# Altium schematic sheet module_slot.SchDoc: PCI Express Mini 52Pin
size A4
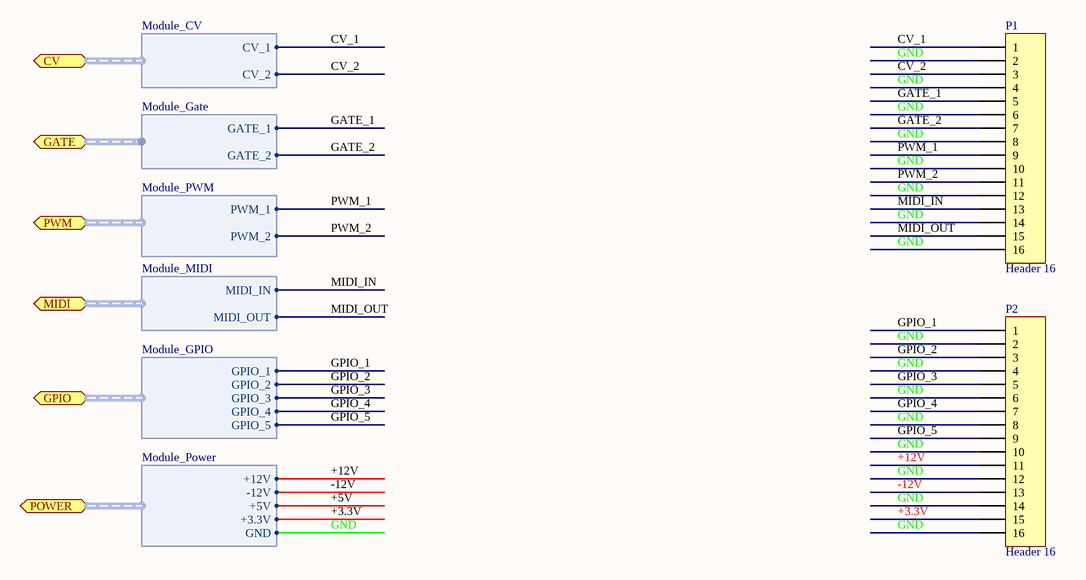
[diagram p0: module_slot.SchDoc]

## Parts
P1  Header 16  [HDR1X16]
P2  Header 16  [HDR1X16]

## Ports
CV (harness Module_CV), GATE (harness Module_Gate), GPIO (harness Module_GPIO), MIDI (harness Module_MIDI), POWER (harness Module_Power), PWM (harness Module_PWM)

## Harnesses
Module_CV: CV_1, CV_2
Module_Gate: GATE_1, GATE_2
Module_PWM: PWM_1, PWM_2
Module_MIDI: MIDI_IN, MIDI_OUT
Module_GPIO: GPIO_1, GPIO_2, GPIO_3, GPIO_4, GPIO_5
Module_Power: +12V, -12V, +5V, GND, +3.3V

## Nets
+3.3V: P2.15 ; port POWER.+3.3V
+5V: port POWER.+5V
+12V: P2.11 ; port POWER.+12V
-12V: P2.13 ; port POWER.-12V
CV_1: P1.1 ; port CV.CV_1
CV_2: P1.3 ; port CV.CV_2
GATE_1: P1.5 ; port GATE.GATE_1
GATE_2: P1.7 ; port GATE.GATE_2
GND: P1.2 P1.4 P1.6 P1.8 P1.10 P1.12 P1.14 P1.16 P2.2 P2.4 P2.6 P2.8 P2.10 P2.12 P2.14 P2.16 ; port POWER.GND
GPIO_1: P2.1 ; port GPIO.GPIO_1
GPIO_2: P2.3 ; port GPIO.GPIO_2
GPIO_3: P2.5 ; port GPIO.GPIO_3
GPIO_4: P2.7 ; port GPIO.GPIO_4
GPIO_5: P2.9 ; port GPIO.GPIO_5
MIDI_IN: P1.13 ; port MIDI.MIDI_IN
MIDI_OUT: P1.15 ; port MIDI.MIDI_OUT
PWM_1: P1.9 ; port PWM.PWM_1
PWM_2: P1.11 ; port PWM.PWM_2

## Notes on the sheet
- Sheet Title
- Project Title
- Size:
- Date:
- A4
- Item:
- Time:
- Revision:
- Sheet
- of
- File:

## Library data of the parts
P1 P2 = Header 16: Header, 16-Pin; LatestRevisionDate: 17-Jul-2002; LatestRevisionNote: Re-released for DXP Platform.; Publisher: Altium Limited